# Altium schematic sheet main.SchDoc
size A3; DocumentNumber: 1; SheetNumber: 1; SheetTotal: 4
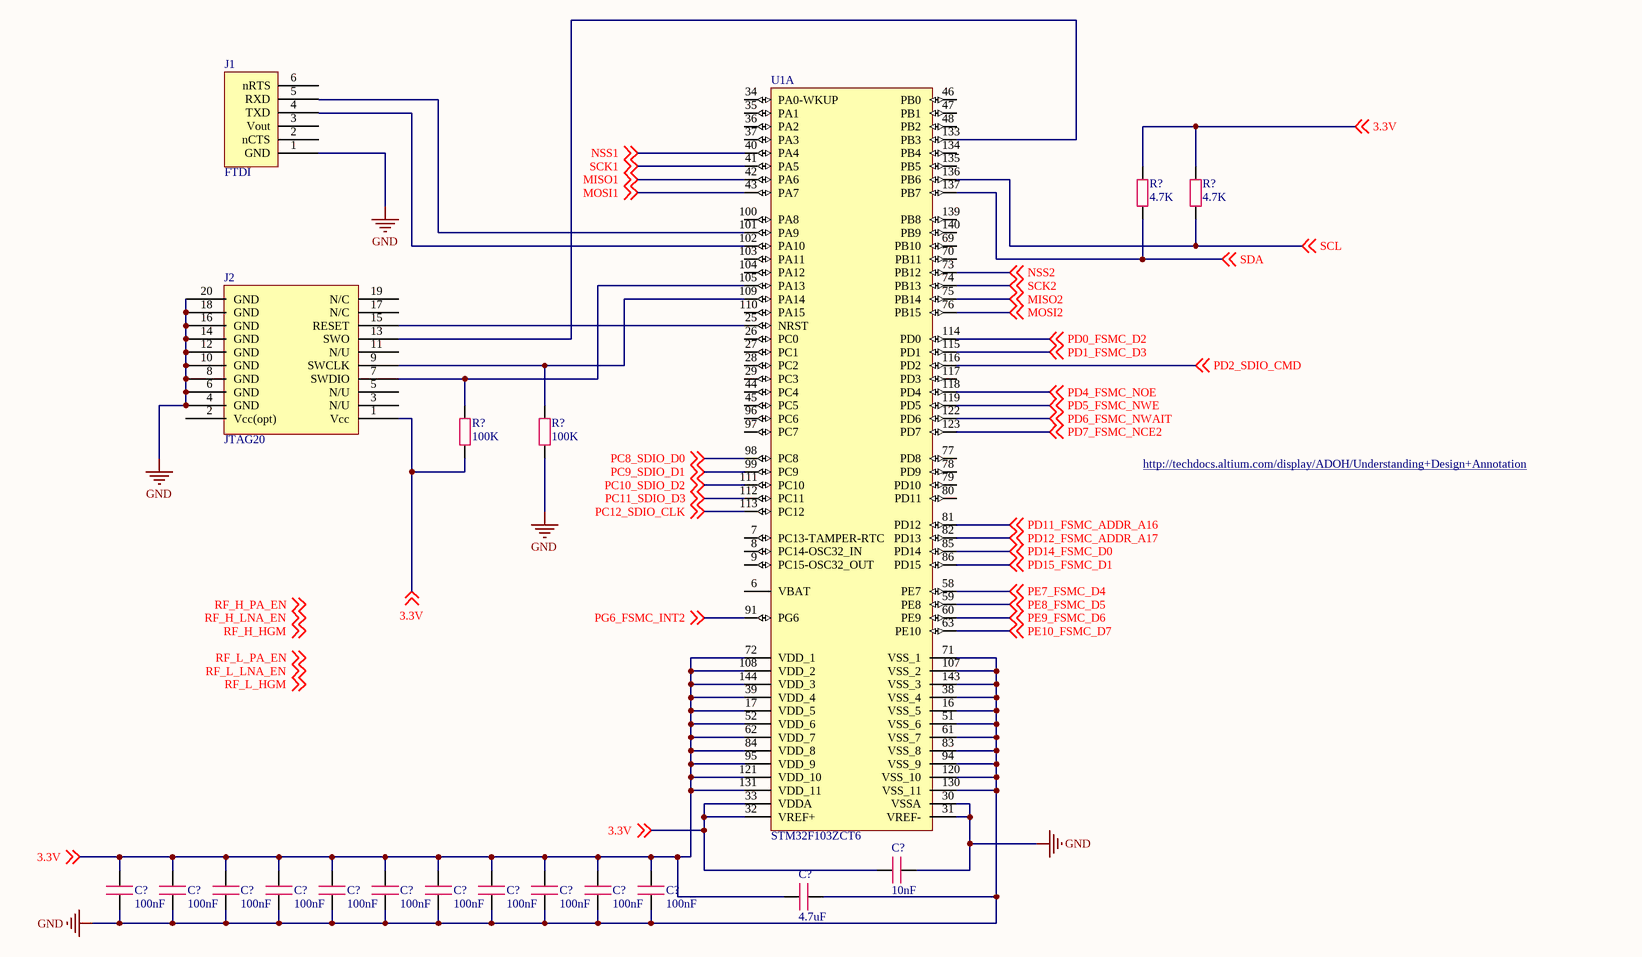
[diagram p0: main.SchDoc]

## Parts
(Parts that share a designator on the sheet are numbered #1, #2 ... from top to bottom, then left to right.)
C?#1  value 10nF  [C0402]  (hidden comment: Capacity)
C?#2  value 100nF  [C0402]  (hidden comment: Capacity)
C?#3  value 100nF  [C0402]  (hidden comment: Capacity)
C?#4  value 100nF  [C0402]  (hidden comment: Capacity)
C?#5  value 100nF  [C0402]  (hidden comment: Capacity)
C?#6  value 100nF  [C0402]  (hidden comment: Capacity)
C?#7  value 100nF  [C0402]  (hidden comment: Capacity)
C?#8  value 100nF  [C0402]  (hidden comment: Capacity)
C?#9  value 100nF  [C0402]  (hidden comment: Capacity)
C?#10  value 100nF  [C0402]  (hidden comment: Capacity)
C?#11  value 100nF  [C0402]  (hidden comment: Capacity)
C?#12  value 100nF  [C0402]  (hidden comment: Capacity)
C?#13  value 4.7uF  [C0402]  (hidden comment: Capacity)
J1  FTDI
J2  JTAG20
R?#1  value 4.7K  [R0402]  (hidden comment: Resistor)
R?#2  value 4.7K  [R0402]  (hidden comment: Resistor)
R?#3  value 100K  [R0402]  (hidden comment: Resistor)
R?#4  value 100K  [R0402]  (hidden comment: Resistor)
U1  STM32F103ZCT6  [STM-LQFP144_M]  (part A of 3)

## Nets
GND: C?#1.1 C?#2.2 C?#3.2 C?#4.2 C?#5.2 C?#6.2 C?#7.2 C?#8.2 C?#9.2 C?#10.2 C?#11.2 C?#12.2 C?#13.1 J1.1(GND) J2.4(GND) J2.6(GND) J2.8(GND) J2.10(GND) J2.12(GND) J2.14(GND) J2.16(GND) J2.18(GND) J2.20(GND) R?#4.2 U1.16(VSS_5) U1.30(VSSA) U1.31(VREF-) U1.38(VSS_4) U1.51(VSS_6) U1.61(VSS_7) U1.71(VSS_1) U1.83(VSS_8) U1.94(VSS_9) U1.107(VSS_2) U1.120(VSS_10) U1.130(VSS_11) U1.143(VSS_3)
3.3V: C?#1.2 C?#2.1 C?#3.1 C?#4.1 C?#5.1 C?#6.1 C?#7.1 C?#8.1 C?#9.1 C?#10.1 C?#11.1 C?#12.1 C?#13.2 J2.1(Vcc) R?#1.1 R?#2.1 R?#3.2 U1.17(VDD_5) U1.32(VREF+) U1.33(VDDA) U1.39(VDD_4) U1.52(VDD_6) U1.62(VDD_7) U1.72(VDD_1) U1.84(VDD_8) U1.95(VDD_9) U1.108(VDD_2) U1.121(VDD_10) U1.131(VDD_11) U1.144(VDD_3) ; off-sheet 3.3V
MISO1: U1.42(PA6) ; off-sheet MISO1
MISO2: U1.75(PB14) ; off-sheet MISO2
MOSI1: U1.43(PA7) ; off-sheet MOSI1
MOSI2: U1.76(PB15) ; off-sheet MOSI2
NSS1: U1.40(PA4) ; off-sheet NSS1
NSS2: U1.73(PB12) ; off-sheet NSS2
PC8_SDIO_D0: U1.98(PC8) ; off-sheet PC8_SDIO_D0
PC9_SDIO_D1: U1.99(PC9) ; off-sheet PC9_SDIO_D1
PC10_SDIO_D2: U1.111(PC10) ; off-sheet PC10_SDIO_D2
PC11_SDIO_D3: U1.112(PC11) ; off-sheet PC11_SDIO_D3
PC12_SDIO_CLK: U1.113(PC12) ; off-sheet PC12_SDIO_CLK
PD0_FSMC_D2: U1.114(PD0) ; off-sheet PD0_FSMC_D2
PD1_FSMC_D3: U1.115(PD1) ; off-sheet PD1_FSMC_D3
PD2_SDIO_CMD: U1.116(PD2) ; off-sheet PD2_SDIO_CMD
PD4_FSMC_NOE: U1.118(PD4) ; off-sheet PD4_FSMC_NOE
PD5_FSMC_NWE: U1.119(PD5) ; off-sheet PD5_FSMC_NWE
PD6_FSMC_NWAIT: U1.122(PD6) ; off-sheet PD6_FSMC_NWAIT
PD7_FSMC_NCE2: U1.123(PD7) ; off-sheet PD7_FSMC_NCE2
PD11_FSMC_ADDR_A16: U1.81(PD12) ; off-sheet PD11_FSMC_ADDR_A16
PD12_FSMC_ADDR_A17: U1.82(PD13) ; off-sheet PD12_FSMC_ADDR_A17
PD14_FSMC_D0: U1.85(PD14) ; off-sheet PD14_FSMC_D0
PD15_FSMC_D1: U1.86(PD15) ; off-sheet PD15_FSMC_D1
PE7_FSMC_D4: U1.58(PE7) ; off-sheet PE7_FSMC_D4
PE8_FSMC_D5: U1.59(PE8) ; off-sheet PE8_FSMC_D5
PE9_FSMC_D6: U1.60(PE9) ; off-sheet PE9_FSMC_D6
PE10_FSMC_D7: U1.63(PE10) ; off-sheet PE10_FSMC_D7
PG6_FSMC_INT2: U1.91(PG6) ; off-sheet PG6_FSMC_INT2
SCK1: U1.41(PA5) ; off-sheet SCK1
SCK2: U1.74(PB13) ; off-sheet SCK2
SCL: R?#2.2 U1.136(PB6) ; off-sheet SCL
SDA: R?#1.2 U1.137(PB7) ; off-sheet SDA
NetJ2_7: J2.7(SWDIO) R?#3.1 U1.105(PA13)
NetJ2_9: J2.9(SWCLK) R?#4.1 U1.109(PA14)
NetJ2_13: J2.13(SWO) U1.133(PB3)
NetJ2_15: J2.15(RESET) U1.25(NRST)

Not connected (* = marked no-connect by the designer): J1 2(nCTS) 3(Vout) 4(TXD) 5(RXD) 6(nRTS); J2 2(Vcc(opt)) 3(N/U) 5(N/U) 11(N/U) 17(N/C) 19(N/C); U1 6(VBAT) 7(PC13-TAMPER-RTC) 8(PC14-OSC32_IN) 9(PC15-OSC32_OUT) 26(PC0) 27(PC1) 28(PC2) 29(PC3) 34(PA0-WKUP) 35(PA1) 36(PA2) 37(PA3) 44(PC4) 45(PC5) 46(PB0) 47(PB1) 48(PB2) 69(PB10) 70(PB11) 77(PD8) 78(PD9) 79(PD10) 80(PD11) 96(PC6) 97(PC7) 100(PA8) 101(PA9) 102(PA10) 103(PA11) 104(PA12) 110(PA15) 117(PD3) 134(PB4) 135(PB5) 139(PB8) 140(PB9)

## Notes on the sheet
- http://techdocs.altium.com/display/ADOH/Understanding+Design+Annotation
- Labels drawn without touching a wire or pin: RF_H_HGM, RF_H_LNA_EN, RF_H_PA_EN, RF_L_HGM, RF_L_LNA_EN, RF_L_PA_EN

## Library data of the parts
J1 = FTDI: FTDI 6-pin connector
J2 = JTAG20: SWD/JTAG 20 pin connector
U1 = STM32F103ZCT6: ARM Cortex-M3 32-bit MCU, 256 KB Flash, 48 KB Internal RAM, 112 I/Os, 144-pin LQFP, -40 to 85 degC, Tray; A/D Converter: 3x12-bit (21 Channel); D/A Converter: 2x12-bit (2 Channel); FLASH Size (Prog) (kB): 256; I/Os (High Current): 112; Internal RAM Size (kB): 48; Operating Frequency(F) (Processor speed) (MHz): 72; Supply Voltage(Vcc) min (V): 2; DatasheetVersion: Rev. 8; PackageVersion: Rev. 4, 06/2013; PackageReference: LQFP144; PackageDescription: 144-Pin Low Profile Quad Flat Package, 20 x 20 mm Body, 0.5 mm Pitch; Supplier 1: Digi-Key; Supplier Part Number 1: 497-11542-ND; Supplier 2: Farnell; Supplier Part Number 2: 1624142; Supplier 3: Newark; Supplier Part Number 3: 57P1265; Supplier 4: Mouser; Supplier Part Number 4: 511-STM32F103ZCT6; Core: ARM Cortex-M3; Packing: Tray; Mounting Technology: Surface Mount; PartNumber: STM32F103ZCT6; ComponentLink1Description: Manufacturer URL; ComponentLink1URL: http://www.st.com/web/en/home.html; ComponentLink2Description: Datasheet; ComponentLink2URL: http://www.st.com/st-web-ui/static/active/en/resource/technical/document/datasheet/CD00191185.pdf; ComponentLink3Description: Package Specification; ComponentLink3URL: http://www.st.com/st-web-ui/static/active/en/resource/technical/document/datasheet/DM00037051.pdf